# EAGLE design schizoid (EAGLE 7.6.0)
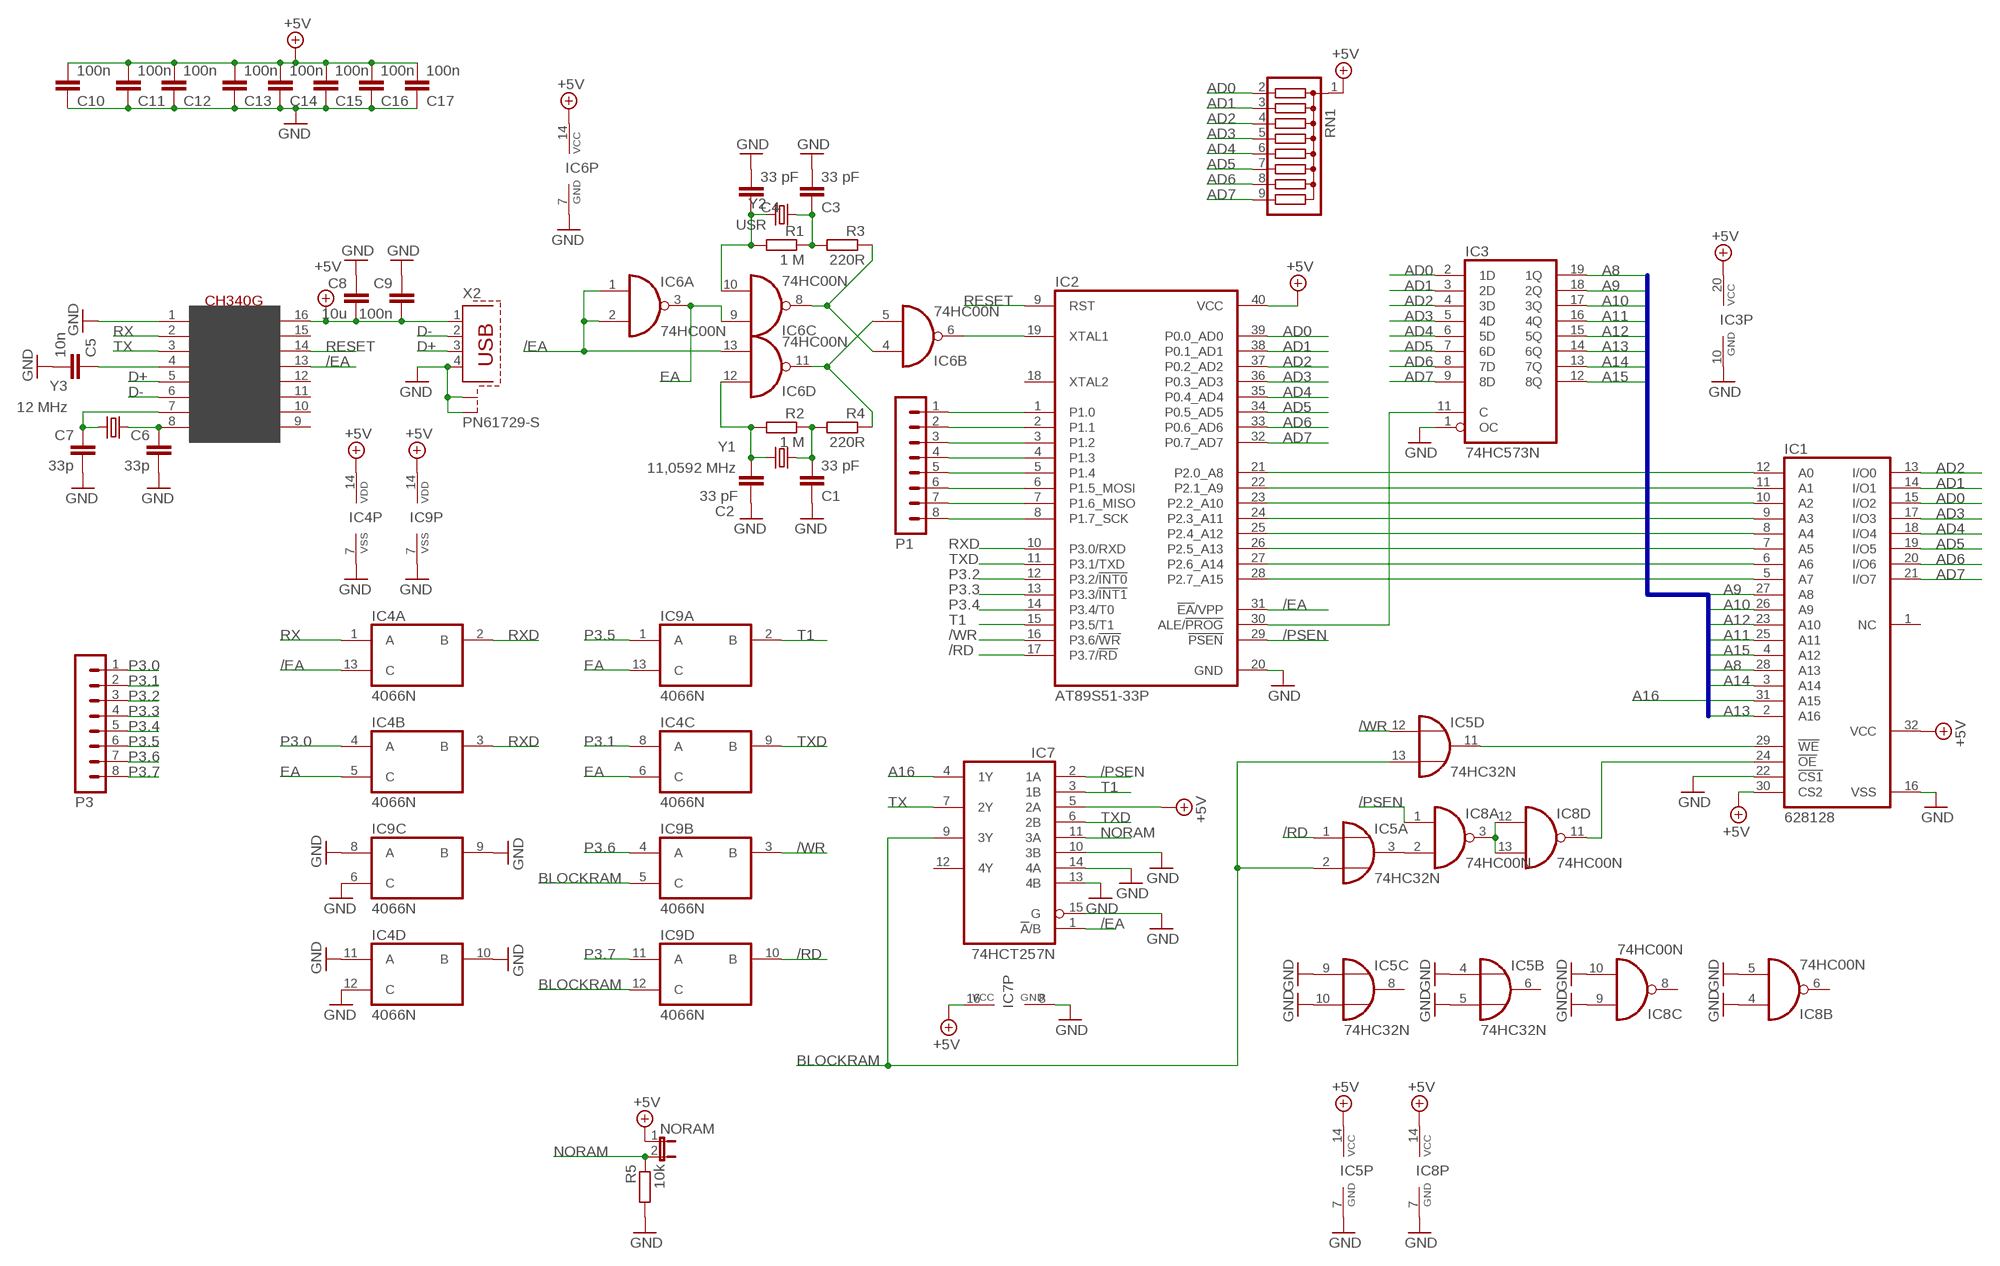
[diagram p0: schematic, sheet 1]

## Parts
C1  33 pF  C-EU025-025X050  [C025-025X050]
C2  33 pF  C-EU025-025X050  [C025-025X050]
C3  33 pF  C-EU025-025X050  [C025-025X050]
C4  33 pF  C-EU025-025X050  [C025-025X050]
C5  10n  C-EU025-025X050  [C025-025X050]
C6  33p  C-EU025-025X050  [C025-025X050]
C7  33p  C-EU025-025X050  [C025-025X050]
C8  10u  C-EU025-025X050  [C025-025X050]
C9  100n  C-EU025-025X050  [C025-025X050]
C10  100n  C-EU025-025X050  [C025-025X050]
C11  100n  C-EU025-025X050  [C025-025X050]
C12  100n  C-EU025-025X050  [C025-025X050]
C13  100n  C-EU025-025X050  [C025-025X050]
C14  100n  C-EU025-025X050  [C025-025X050]
C15  100n  C-EU025-025X050  [C025-025X050]
C16  100n  C-EU025-025X050  [C025-025X050]
C17  100n  C-EU025-025X050  [C025-025X050]
IC1  628128  628128P  [DIL32]
IC2  AT89S51-33P  [DIL40]
IC3  74HC573N  [DIL20]
IC4  4066N  [DIL14]
IC5  74HC32N  [DIL14]
IC6  74HC00N  [DIL14]
IC7  74HCT257N  [DIL16]
IC8  74HC00N  [DIL14]
IC9  4066N  [DIL14]
NORAM  JP1E  [JP1]
P1  MA08-1  [MA08-1]
P3  MA08-1  [MA08-1]
R1  1 M  R-EU_0207/7  [0207/7]
R2  1 M  R-EU_0207/7  [0207/7]
R3  220R  R-EU_0207/7  [0207/7]
R4  220R  R-EU_0207/7  [0207/7]
R5  10k  R-EU_0207/7  [0207/7]
RN1  G08R  [SIL9]
U$1  CH340G  [SOIC16]
X2  PN61729-S  [PN61729-S]
Y1  11,0592 MHz  CRYSTALHC49UV  [HC49U-V]
Y2  USR  CRYSTALHC49UV  [HC49U-V]
Y3  12 MHz  CRYSTALHC49UV  [HC49U-V]

## Nets
+5V: C8.2 C9.2 C10.2 C11.2 C12.2 C13.2 C14.2 C15.2 C16.2 C17.2 IC1.30(CS2) IC1.32(VCC) IC2.40(VCC) IC3.20(VCC) IC4.14(P:VDD) IC5.14(P:VCC) IC6.14(P:VCC) IC7.5(2A) IC7.16(VCC) IC8.14(P:VCC) IC9.14(P:VDD) NORAM.1 RN1.1 U$1.16(VCC) X2.1
/EA: IC2.31(!EA!/VPP) IC4.13(A:C) IC6.1(A:I0) IC6.2(A:I1) IC6.13(D:I1) IC7.1(!A!/B) U$1.13(DTR)
/PSEN: IC2.29(!PSEN) IC7.2(1A) IC8.1(A:I0)
/RD: IC2.17(P3.7/!RD) IC5.1(A:I0) IC9.10(D:B)
/WR: IC2.16(P3.6/!WR) IC5.12(D:I0) IC9.3(B:B)
A8: IC1.28(A13) IC3.19(1Q)
A9: IC1.27(A8) IC3.18(2Q)
A10: IC1.26(A9) IC3.17(3Q)
A11: IC1.25(A11) IC3.16(4Q)
A12: IC1.23(A10) IC3.15(5Q)
A13: IC1.2(A16) IC3.14(6Q)
A14: IC1.3(A14) IC3.13(7Q)
A15: IC1.4(A12) IC3.12(8Q)
A16: IC1.31(A15) IC7.4(1Y)
AD0: IC1.15(I/O2) IC2.39(P0.0_AD0) IC3.2(1D) RN1.2
AD1: IC1.14(I/O1) IC2.38(P0.1_AD1) IC3.3(2D) RN1.3
AD2: IC1.13(I/O0) IC2.37(P0.2_AD2) IC3.4(3D) RN1.4
AD3: IC1.17(I/O3) IC2.36(P0.3_AD3) IC3.5(4D) RN1.5
AD4: IC1.18(I/O4) IC2.35(P0.4_AD4) IC3.6(5D) RN1.6
AD5: IC1.19(I/O5) IC2.34(P0.5_AD5) IC3.7(6D) RN1.7
AD6: IC1.20(I/O6) IC2.33(P0.6_AD6) IC3.8(7D) RN1.8
AD7: IC1.21(I/O7) IC2.32(P0.7_AD7) IC3.9(8D) RN1.9
BLOCKRAM: IC5.2(A:I1) IC5.13(D:I1) IC7.9(3Y) IC9.5(B:C) IC9.12(D:C)
D+: U$1.5(D+) X2.3
D-: U$1.6(D-) X2.2
EA: IC4.5(B:C) IC4.6(C:C) IC6.3(A:O) IC6.9(C:I0) IC9.13(A:C)
GND: C1.1 C2.1 C3.2 C4.2 C5.2 C6.2 C7.2 C8.1 C9.1 C10.1 C11.1 C12.1 C13.1 C14.1 C15.1 C16.1 C17.1 IC1.16(VSS) IC1.22(!CS1) IC2.20(GND) IC3.1(OC) IC3.10(GND) IC4.7(P:VSS) IC4.10(D:B) IC4.11(D:A) IC4.12(D:C) IC5.4(B:I0) IC5.5(B:I1) IC5.7(P:GND) IC5.9(C:I0) IC5.10(C:I1) IC6.7(P:GND) IC7.8(GND) IC7.10(3B) IC7.13(4B) IC7.14(4A) IC7.15(G) IC8.4(B:I0) IC8.5(B:I1) IC8.7(P:GND) IC8.9(C:I0) IC8.10(C:I1) IC9.6(C:C) IC9.7(P:VSS) IC9.8(C:A) IC9.9(C:B) R5.2 U$1.1(GND) X2.4 X2.S1 X2.S2
N$1: IC1.12(A0) IC2.21(P2.0_A8)
N$2: IC1.11(A1) IC2.22(P2.1_A9)
N$3: IC1.10(A2) IC2.23(P2.2_A10)
N$4: IC1.9(A3) IC2.24(P2.3_A11)
N$5: IC1.8(A4) IC2.25(P2.4_A12)
N$6: IC1.7(A5) IC2.26(P2.5_A13)
N$7: IC1.6(A6) IC2.27(P2.6_A14)
N$8: IC1.5(A7) IC2.28(P2.7_A15)
N$9: IC2.30(ALE/!PROG) IC3.11(C)
N$10: C3.1 R1.1 R3.2 Y2.1
N$11: IC2.1(P1.0) P1.1
N$12: C1.2 R2.1 R4.2 Y1.1
N$13: IC2.2(P1.1) P1.2
N$14: IC2.3(P1.2) P1.3
N$15: IC2.4(P1.3) P1.4
N$16: IC2.5(P1.4) P1.5
N$17: IC2.6(P1.5_MOSI) P1.6
N$18: IC2.7(P1.6_MISO) P1.7
N$19: IC5.3(A:O) IC8.2(A:I1)
N$20: IC6.4(B:I0) IC6.8(C:O) R3.1
N$21: IC8.3(A:O) IC8.12(D:I0) IC8.13(D:I1)
N$22: IC6.5(B:I1) IC6.11(D:O) R4.1
N$23: C2.2 IC6.12(D:I0) R2.2 Y1.2
N$24: IC2.8(P1.7_SCK) P1.8
N$25: C4.1 IC6.10(C:I1) R1.2 Y2.2
N$26: IC2.19(XTAL1) IC6.6(B:O)
N$27: C5.1 U$1.4(V3)
N$28: C6.1 U$1.8(XO) Y3.1
N$31: C7.1 U$1.7(XI) Y3.2
N$35: IC1.29(!WE) IC5.11(D:O)
N$36: IC1.24(!OE) IC8.11(D:O)
NORAM: IC7.11(3A) NORAM.2 R5.1
P3.0: IC4.4(B:A) P3.1
P3.1: IC4.8(C:A) P3.2
P3.2: IC2.12(P3.2/!INT0) P3.3
P3.3: IC2.13(P3.3/!INT1) P3.4
P3.4: IC2.14(P3.4/T0) P3.5
P3.5: IC9.1(A:A) P3.6
P3.6: IC9.4(B:A) P3.7
P3.7: IC9.11(D:A) P3.8
RESET: IC2.9(RST) U$1.14(RTS)
RX: IC4.1(A:A) U$1.2(TX)
RXD: IC2.10(P3.0/RXD) IC4.2(A:B) IC4.3(B:B)
T1: IC2.15(P3.5/T1) IC7.3(1B) IC9.2(A:B)
TX: IC7.7(2Y) U$1.3(RX)
TXD: IC2.11(P3.1/TXD) IC4.9(C:B) IC7.6(2B)
Unconnected: IC1.1(NC) IC2.18(XTAL2) IC5.6(B:O) IC5.8(C:O) IC7.12(4Y) IC8.6(B:O) IC8.8(C:O) U$1.9(CTS) U$1.10(DSR) U$1.11(RI) U$1.12(DCD) U$1.15(RS232)

## Buses
A[8..16]

## Library data of the parts
C1-C17 = rcl:C-EU: CAPACITOR, European symbol
IC1 = memory-hitachi:628128P: MEMORY; OC_FARNELL: unknown; OC_NEWARK: unknown
IC2 = atmel:AT89S51-*: 8-bit Microcontroller with 4K BytesIn-System Programmable Flash Source: http://www.atmel.com/dyn/resources/prod_documents/doc2487.pdf; MPN: AT89S51-24PU; OC_FARNELL: 1095739; OC_NEWARK: 96K6578
IC3 = 74xx-eu:74*573: 8-bit D latch BUS DRIVER
IC4 IC9 = 40xx:4066: Quad bilateral ANALOG SWITCH
IC5 = 74xx-eu:74*32: Quad 2-input OR gate
IC6 IC8 = 74xx-eu:74*00: Quad 2-input NAND gate
IC7 = 74xx-eu:74*257: Quadruple 2-to 1 line data SELECTOR/MULTIPLEXER
NORAM = jumper:JP1E: JUMPER
P1 P3 = con-lstb:MA08-1: PIN HEADER; OC_FARNELL: unknown; OC_NEWARK: unknown
R1-R5 = rcl:R-EU_: RESISTOR, European symbol
RN1 = resistor-sil:G08R: SIL RESISTOR; OC_FARNELL: unknown; OC_NEWARK: unknown
U$1 = usb-serial:CH340G
X2 = con-berg:PN61729-S: BERG USB connector; OC_FARNELL: unknown; OC_NEWARK: unknown
Y1-Y3 = SparkFun-FreqCtrl:CRYSTAL: Various standard crystals. Proven footprints.

## Board
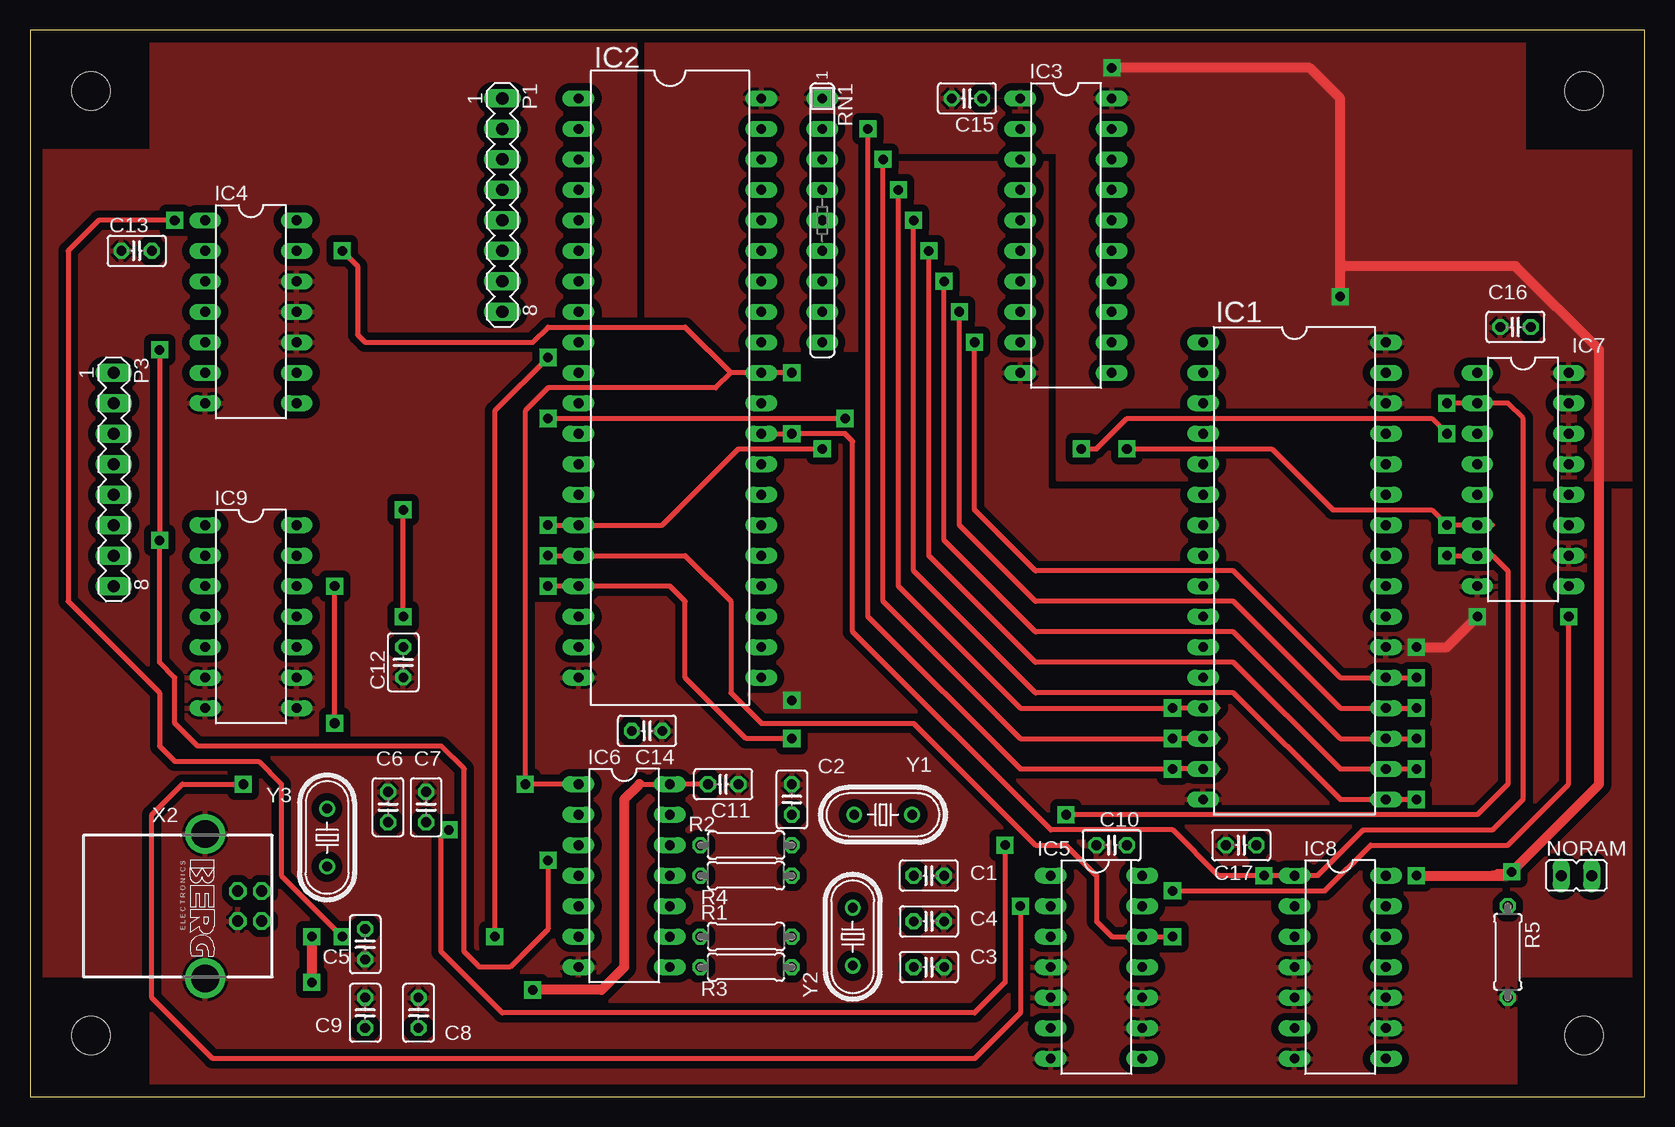
[diagram p1: board, top side]
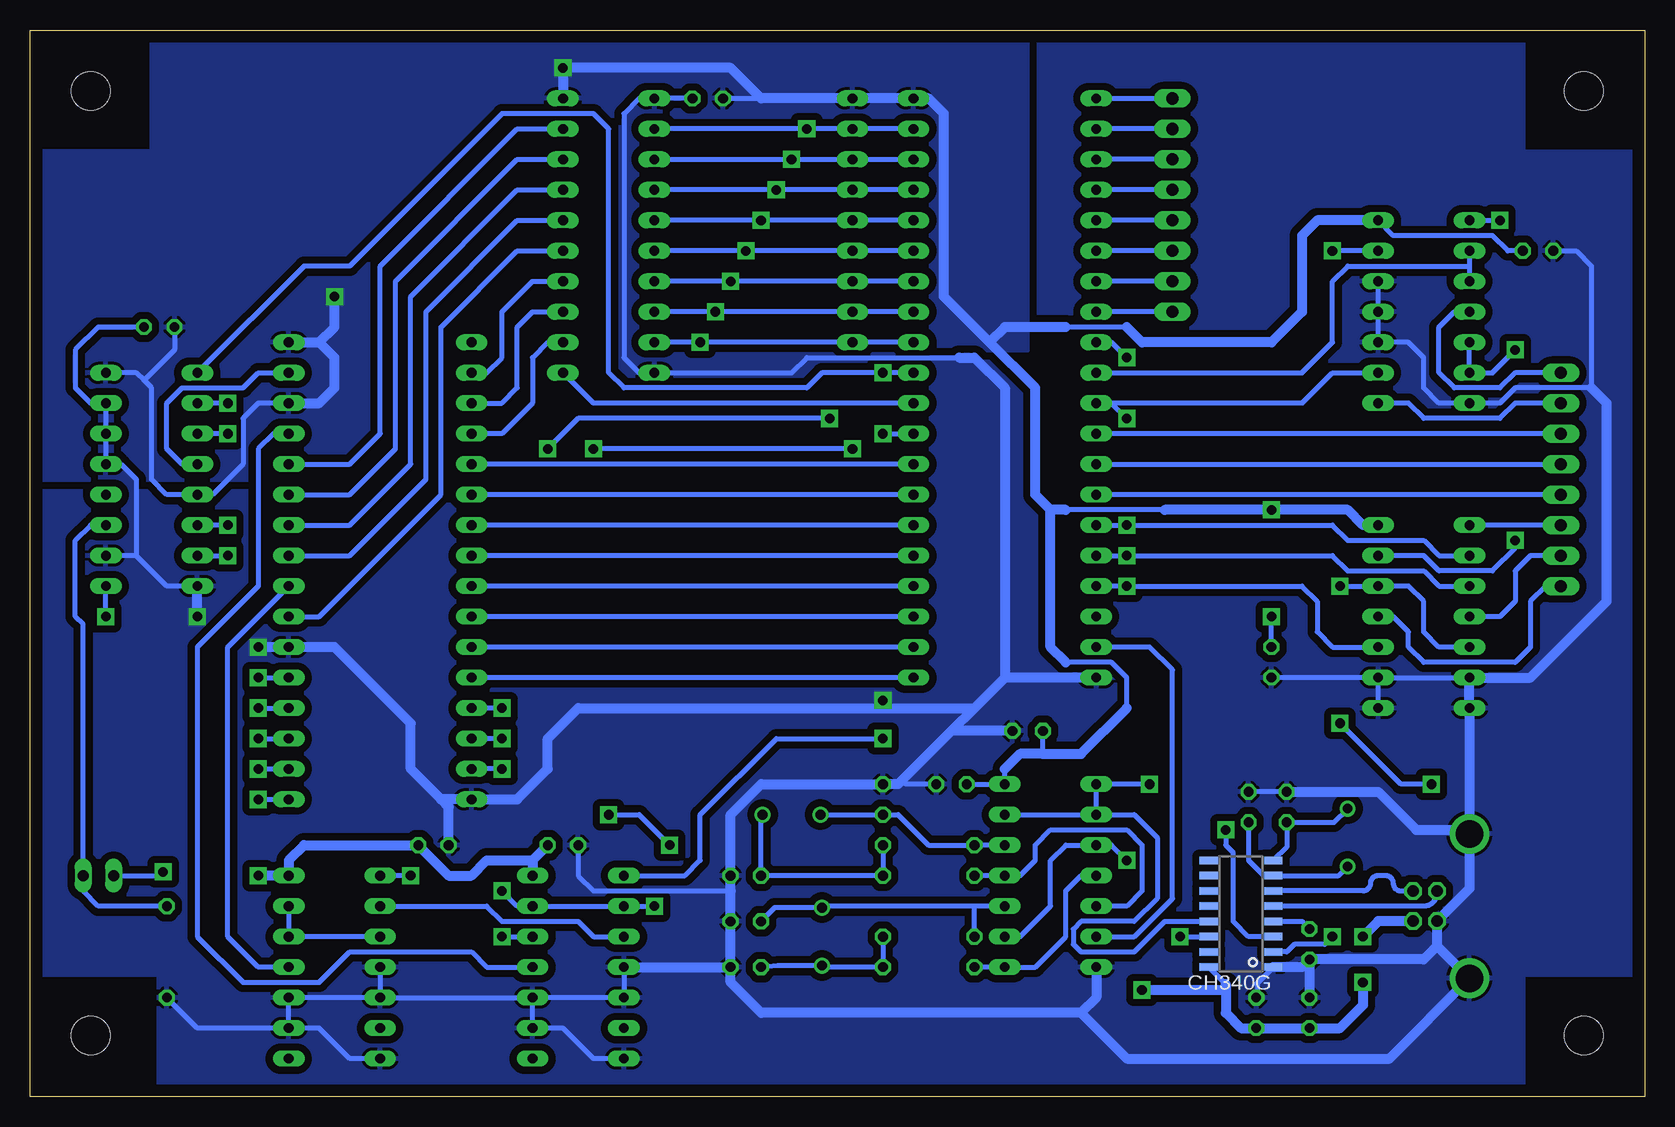
[diagram p2: board, bottom side, seen from below]

Size 134.6 x 88.89 mm. Coordinates in mm from the lower left corner, seen from the top.
Outline: 0,0 134.6,0 134.6,88.89 0,88.89 0,0
Copper layers (1*16): Top 0.035mm / dielectric 1.5mm / Bottom 0.035mm
Design rules "default": minimum track width 10mil, minimum drill 24mil, track to track 8mil, track to pad 8mil, pad to pad 8mil, via to via 8mil, smd to smd 8mil, copper to edge 40mil, drill to drill 8mil, minimum pad ring 10mil, minimum via ring 8mil, stop-mask expansion 4mil, vias tented up to drill 0mil, thermal gap 10mil
Holes 3.2 mm at 5.08,5.08 129.54,5.08 129.54,83.82 5.08,83.82

### Footprints (pad centres in the part's own frame; a part is rotated, then mirrored left to right if it is on the bottom)
C025-025X050 = drill 0.813 octagon: 1 -1.27,0; 2 1.27,0
DIL32 = drill 0.813 long: 1 -19.05,-7.62; 2 -16.51,-7.62; 3 -13.97,-7.62; 4 -11.43,-7.62; 5 -8.89,-7.62; 6 -6.35,-7.62; 7 -3.81,-7.62; 8 -1.27,-7.62; 9 1.27,-7.62; 10 3.81,-7.62; 11 6.35,-7.62; 12 8.89,-7.62; 13 11.43,-7.62; 14 13.97,-7.62; 15 16.51,-7.62; 16 19.05,-7.62; 17 19.05,7.62; 18 16.51,7.62; 19 13.97,7.62; 20 11.43,7.62; 21 8.89,7.62; 22 6.35,7.62; 23 3.81,7.62; 24 1.27,7.62; 25 -1.27,7.62; 26 -3.81,7.62; 27 -6.35,7.62; 28 -8.89,7.62; 29 -11.43,7.62; 30 -13.97,7.62; 31 -16.51,7.62; 32 -19.05,7.62
DIL40 = drill 0.813 long: 1 -24.13,-7.62; 2 -21.59,-7.62; 3 -19.05,-7.62; 4 -16.51,-7.62; 5 -13.97,-7.62; 6 -11.43,-7.62; 7 -8.89,-7.62; 8 -6.35,-7.62; 9 -3.81,-7.62; 10 -1.27,-7.62; 11 1.27,-7.62; 12 3.81,-7.62; 13 6.35,-7.62; 14 8.89,-7.62; 15 11.43,-7.62; 16 13.97,-7.62; 17 16.51,-7.62; 18 19.05,-7.62; 19 21.59,-7.62; 20 24.13,-7.62; 21 24.13,7.62; 22 21.59,7.62; 23 19.05,7.62; 24 16.51,7.62; 25 13.97,7.62; 26 11.43,7.62; 27 8.89,7.62; 28 6.35,7.62; 29 3.81,7.62; 30 1.27,7.62; 31 -1.27,7.62; 32 -3.81,7.62; 33 -6.35,7.62; 34 -8.89,7.62; 35 -11.43,7.62; 36 -13.97,7.62; 37 -16.51,7.62; 38 -19.05,7.62; 39 -21.59,7.62; 40 -24.13,7.62
DIL20 = drill 0.813 long: 1 -11.43,-3.81; 2 -8.89,-3.81; 3 -6.35,-3.81; 4 -3.81,-3.81; 5 -1.27,-3.81; 6 1.27,-3.81; 7 3.81,-3.81; 8 6.35,-3.81; 9 8.89,-3.81; 10 11.43,-3.81; 11 11.43,3.81; 12 8.89,3.81; 13 6.35,3.81; 14 3.81,3.81; 15 1.27,3.81; 16 -1.27,3.81; 17 -3.81,3.81; 18 -6.35,3.81; 19 -8.89,3.81; 20 -11.43,3.81
DIL14 = drill 0.813 long: 1 -7.62,-3.81; 2 -5.08,-3.81; 3 -2.54,-3.81; 4 0,-3.81; 5 2.54,-3.81; 6 5.08,-3.81; 7 7.62,-3.81; 8 7.62,3.81; 9 5.08,3.81; 10 2.54,3.81; 11 0,3.81; 12 -2.54,3.81; 13 -5.08,3.81; 14 -7.62,3.81
DIL16 = drill 0.813 long: 1 -8.89,-3.81; 2 -6.35,-3.81; 3 -3.81,-3.81; 4 -1.27,-3.81; 5 1.27,-3.81; 6 3.81,-3.81; 7 6.35,-3.81; 8 8.89,-3.81; 9 8.89,3.81; 10 6.35,3.81; 11 3.81,3.81; 12 1.27,3.81; 13 -1.27,3.81; 14 -3.81,3.81; 15 -6.35,3.81; 16 -8.89,3.81
JP1 = drill 0.914 long: 1 0,-1.27; 2 0,1.27
MA08-1 = drill 1.016 long: 1 -8.89,0; 2 -6.35,0; 3 -3.81,0; 4 -1.27,0; 5 1.27,0; 6 3.81,0; 7 6.35,0; 8 8.89,0
0207/7 = drill 0.813 octagon: 1 -3.81,0; 2 3.81,0
SIL9 = drill 0.813 long: 1 -10.16,0; 2 -7.62,0; 3 -5.08,0; 4 -2.54,0; 5 0,0; 6 2.54,0; 7 5.08,0; 8 7.62,0; 9 10.16,0
SOIC16 = smd 0.635 x 1.524: 1 -4.445,-2.695; 2 -3.175,-2.695; 3 -1.905,-2.695; 4 -0.635,-2.695; 5 0.635,-2.695; 6 1.905,-2.695; 7 3.175,-2.695; 8 4.445,-2.695; 9 4.445,2.695; 10 3.175,2.695; 11 1.905,2.695; 12 0.635,2.695; 13 -0.635,2.695; 14 -1.905,2.695; 15 -3.175,2.695; 16 -4.445,2.695
PN61729-S = drill 0.95 octagon: 1 1.25,4.71; 2 -1.25,4.71; 3 -1.25,2.71; 4 1.25,2.71 | drill 2.3 pad 2.9: S1 -6.02,0; S2 6.02,0
HC49U-V = drill 0.813: 1 -2.413,0; 2 2.413,0

### Placement (x,y rotation side)
C1  74.93,18.41 180 top
C2  63.5,24.77 270 top
C3  74.93,10.79 0 top
C4  74.93,14.61 0 top
C5  27.94,12.7 270 top
C6  29.84,24.13 90 top
C7  33.02,24.13 90 top
C8  32.38,6.99 270 top
C9  27.94,6.99 270 top
C10  90.17,20.95 0 top
C11  57.78,26.04 180 top
C12  31.11,36.2 90 top
C13  8.89,70.48 0 top
C14  51.44,30.48 180 top
C15  78.11,83.19 180 top
C16  123.83,64.14 180 top
C17  100.97,20.95 0 top
IC1  105.41,43.81 270 top
IC2  53.34,59.05 270 top
IC3  86.36,71.75 270 top
IC4  18.41,65.41 270 top
IC5  88.9,10.79 270 top
IC6  49.53,18.41 270 top
IC7  124.46,51.44 270 top
IC8  109.22,10.79 270 top
IC9  18.41,40.01 270 top
NORAM  128.91,18.41 270 top
P1  39.37,74.3 270 top
P3  6.99,51.44 270 top
R1  59.69,13.34 180 top
R2  59.69,20.95 180 top
R3  59.69,10.79 0 top
R4  59.69,18.41 0 top
R5  123.19,12.06 270 top
RN1  66.04,73.03 270 top
U$1  33.66,15.24 90 bottom
X2  14.61,15.88 270 top
Y1  71.12,23.5 180 top
Y2  68.58,13.34 90 top
Y3  24.77,21.59 270 top

### Tracks (layer width: path | path; a pad name or v marks a point on that pad's centre or on a via)
+5V  (via drill 0.8 pad 1.42)
  Top 0.406: v31.11,40.01 v31.11,48.9 | v123.51,18.73 122.24,18.73 121.92,18.41 | 50.8,26.04 IC6.14 C11.2
  Top 0.813: v109.22,66.67 109.22,69.22 | 109.22,69.22 109.22,83.19 106.68,85.72 v90.17,85.72 | v115.57,18.41 121.92,18.41 123.19,18.41 v123.51,18.73 130.81,26.04 130.81,62.23 123.83,69.22 109.22,69.22 | v23.5,13.34 v23.5,9.53 | v41.91,8.89 47.62,8.89 49.53,10.79 49.53,24.77 50.8,26.04
  Bottom 0.406: 125.09,59.69 124.46,59.05 124.46,51.44 123.19,50.16 IC7.5 119.38,50.16 116.84,52.7 116.84,56.52 115.57,57.78 IC1.30 | 125.09,59.69 125.73,60.33 IC7.16 | 40.01,48.9 48.26,48.9 | 43.18,64.14 48.26,64.14 | 43.18,32.38 43.18,34.92 44.45,36.2 48.26,36.2 | C12.2 v31.11,40.01 | C13.2 11.43,70.48 12.7,71.75 20.95,71.75 IC4.14 | 50.16,28.57 C14.2 | C15.2 73.66,83.19 | C16.2 122.56,62.23 125.09,59.69 | NORAM.1 123.83,18.41 v123.51,18.73 | 34.92,9.37 U$1.16 | C11.2 IC6.14 53.34,27.3
  Bottom 0.813: IC1.30 110.49,57.78 109.22,59.05 109.22,61.59 110.49,62.87 | IC1.32 110.49,62.87 | 110.49,62.87 109.22,64.14 v109.22,66.67 | IC3.20 v90.17,85.72 76.2,85.72 73.66,83.19 RN1.1 IC2.40 59.69,83.19 58.42,81.92 58.42,66.67 54.61,62.87 | IC9.14 23.5,47.62 24.77,48.9 v31.11,48.9 40.01,48.9 | 48.26,48.9 49.53,48.9 | 49.53,48.9 50.8,50.16 50.8,59.05 54.61,62.87 | IC4.14 27.3,73.03 28.57,71.75 28.57,65.41 31.11,62.87 41.91,62.87 43.18,64.14 | 48.26,64.14 53.34,64.14 54.61,62.87 | 43.18,32.38 46.99,28.57 50.16,28.57 52.07,28.57 53.34,27.3 | v115.57,18.41 IC8.14 113.03,19.68 111.76,20.95 C17.2 99.69,18.41 97.79,18.41 96.52,19.68 92.71,19.68 | 48.26,36.2 49.53,37.47 49.53,48.9 | C10.2 92.71,19.68 | 92.71,19.68 IC5.14 | X2.1 22.2,14.62 v23.5,13.34 | v23.5,9.53 23.5,7.62 25.4,5.71 C9.2 C8.2 33.66,5.71 34.92,6.99 34.92,8.89 | 34.92,9.37 34.92,8.89 | v41.91,8.89 34.92,8.89
  pour Bottom (isolate 0.61): 51.44,88.9 124.46,88.9 124.46,78.74 134.62,78.74 134.62,51.44 85.72,51.44 85.72,78.74 69.85,78.74 69.85,62.23 51.44,62.23
  pour Top (isolate 0.61): 51.44,88.9 124.46,88.9 124.46,78.74 134.62,78.74 134.62,51.44 85.72,51.44 85.72,78.74 69.85,78.74 69.85,62.23 51.44,62.23
/EA  (via drill 0.8 pad 1.42)
  Top 0.406: v63.5,60.33 58.42,60.33 | v26.04,70.48 27.3,69.22 27.3,63.5 27.94,62.87 41.91,62.87 43.18,64.14 54.61,64.14 58.42,60.33 | 58.42,60.33 57.15,59.05 43.18,59.05 41.27,57.15 v41.27,26.04 46.35,26.04
  Bottom 0.406: IC6.13 IC6.2 | IC6.2 IC6.1 v41.27,26.04 | IC7.1 111.76,69.22 107.95,69.22 95.25,81.92 87.63,81.92 86.36,80.64 86.36,60.33 85.09,59.05 69.85,59.05 68.58,60.33 v63.5,60.33 IC2.31 | IC4.13 v26.04,70.48 | IC6.2 42.55,23.5 40.64,21.59 40.64,16.51 42.55,14.61 46.99,14.61 47.62,13.97 47.62,12.7 46.99,12.06 42.55,12.06 40.01,14.61 U$1.13
/PSEN  (via drill 0.8 pad 1.42)
  Top 0.406: 60.33,55.24 v63.5,55.24 67.94,55.24 68.58,54.61 68.58,38.73 85.09,22.23 95.25,22.23 99.06,18.41 v102.87,18.41 107.31,18.41 111.12,22.23 121.92,22.23 124.46,24.77 124.46,56.52 123.19,57.78 v118.11,57.78
  Bottom 0.406: v63.5,55.24 IC2.29 | v102.87,18.41 IC8.1 | v118.11,57.78 IC7.2
/RD  (via drill 0.8 pad 1.42)
  Top 0.406: v63.5,29.84 59.69,29.84 54.61,34.92 54.61,41.27 53.34,42.55 v43.18,42.55
  Bottom 0.406: IC9.10 26.04,37.47 27.3,38.73 27.3,41.27 28.57,42.55 v43.18,42.55 IC2.17 | v63.5,29.84 72.39,29.84 78.74,23.5 78.74,19.68 80.01,18.41 IC5.1
/WR  (via drill 0.8 pad 1.42)
  Top 0.406: v43.18,45.09 54.61,45.09 58.42,41.27 58.42,33.66 60.96,31.11 73.66,31.11 83.82,20.95 86.36,20.95 88.9,18.41 88.9,14.61 90.17,13.34 v95.25,13.34
  Bottom 0.406: IC9.3 17.14,42.55 18.41,43.81 24.77,43.81 26.04,45.09 v43.18,45.09 IC2.16 | v95.25,13.34 IC5.12
A8
  Bottom 0.406: IC1.28 107.95,52.7 105.41,55.24 105.41,69.22 93.98,80.64 IC3.19
A9
  Bottom 0.406: IC1.27 107.95,50.16 104.14,53.98 104.14,67.94 93.98,78.11 IC3.18
A10
  Bottom 0.406: IC1.26 107.95,47.62 102.87,52.7 102.87,66.67 93.98,75.56 IC3.17
A11
  Bottom 0.406: IC1.25 107.95,45.09 101.6,51.44 101.6,65.41 93.98,73.03 IC3.16
A12
  Bottom 0.406: IC1.23 110.49,40.01 100.33,50.16 100.33,64.14 93.98,70.48 IC3.15
A13
  Bottom 0.406: IC1.2 96.52,60.33 95.25,61.59 95.25,65.41 92.71,67.94 IC3.14
A14
  Bottom 0.406: IC1.3 95.25,57.78 93.98,59.05 93.98,64.14 92.71,65.41 IC3.13
A15
  Bottom 0.406: IC3.12 91.44,62.87 92.71,61.59 92.71,57.78 95.25,55.24 IC1.4
A16
  Bottom 0.406: IC7.4 121.92,52.7 123.19,53.98 123.19,57.78 121.92,59.05 116.84,59.05 115.57,60.33 IC1.31
AD0  (via drill 0.8 pad 1.42)
  Top 0.406: v69.85,80.64 69.85,40.01 82.55,27.3 v95.25,27.3 99.06,27.3
  Bottom 0.406: IC2.39 RN1.2 v69.85,80.64 IC3.2 | v95.25,27.3 IC1.15
AD1  (via drill 0.8 pad 1.42)
  Top 0.406: v71.12,78.11 71.12,41.27 82.55,29.84 v95.25,29.84 99.06,29.84
  Bottom 0.406: IC3.3 v71.12,78.11 RN1.3 IC2.38 | v95.25,29.84 IC1.14
AD2  (via drill 0.8 pad 1.42)
  Top 0.406: v72.39,75.56 72.39,42.55 82.55,32.38 v95.25,32.38 99.06,32.38
  Bottom 0.406: IC2.37 RN1.4 v72.39,75.56 IC3.4 | v95.25,32.38 IC1.13
AD3  (via drill 0.8 pad 1.42)
  Top 0.406: v73.66,73.03 73.66,43.81 83.82,33.66 100.33,33.66 109.22,24.77 v115.57,24.77
  Bottom 0.406: IC2.36 RN1.5 v73.66,73.03 IC3.5 | v115.57,24.77 IC1.17
AD4  (via drill 0.8 pad 1.42)
  Top 0.406: v74.93,70.48 74.93,45.09 83.82,36.2 100.33,36.2 109.22,27.3 v115.57,27.3
  Bottom 0.406: IC2.35 RN1.6 v74.93,70.48 IC3.6 | v115.57,27.3 IC1.18
AD5  (via drill 0.8 pad 1.42)
  Top 0.406: v76.2,67.94 76.2,46.35 83.82,38.73 100.33,38.73 109.22,29.84 v115.57,29.84
  Bottom 0.406: IC2.34 RN1.7 v76.2,67.94 IC3.7 | v115.57,29.84 IC1.19
AD6  (via drill 0.8 pad 1.42)
  Top 0.406: v77.47,65.41 77.47,47.62 83.82,41.27 100.33,41.27 109.22,32.38 v115.57,32.38
  Bottom 0.406: IC2.33 RN1.8 v77.47,65.41 IC3.8 | v115.57,32.38 IC1.20
AD7  (via drill 0.8 pad 1.42)
  Top 0.406: v78.74,62.87 78.74,48.9 83.82,43.81 100.33,43.81 109.22,34.92 v115.57,34.92
  Bottom 0.406: IC2.32 RN1.9 v78.74,62.87 IC3.9 | v115.57,34.92 IC1.21
BLOCKRAM  (via drill 0.8 pad 1.42)
  Top 0.406: v95.25,17.14 107.95,17.14 111.76,20.95 123.19,20.95 128.27,26.04 v128.27,40.01 | v82.55,15.88 82.55,6.99 78.74,3.17 15.24,3.17 10.16,8.26 10.16,23.5 12.7,26.04 v17.78,26.04 | v25.4,31.11 v25.4,42.55
  Bottom 0.406: IC9.5 17.14,37.47 18.41,38.73 18.41,41.27 19.68,42.55 IC9.12 v25.4,42.55 | v95.25,17.14 93.98,15.88 IC5.13 IC5.2 v82.55,15.88 | v128.27,40.01 IC7.9 | v17.78,26.04 20.32,26.04 v25.4,31.11
D+
  Bottom 0.406: X2.3 17.32,16.98 arc90 18.41,15.88 U$1.5
D-
  Bottom 0.406: X2.2 20.3,17.12 arc90 20.95,17.78 arc-90 21.59,18.41 22.23,18.41 arc-90 22.86,17.78 arc90 23.5,17.14 U$1.6
EA  (via drill 0.8 pad 1.42)
  Top 0.406: v10.79,62.23 v10.79,46.35 10.79,36.2 12.06,34.92 12.06,31.11 13.97,29.21 34.29,29.21 36.2,27.3 36.2,12.06 37.47,10.79 40.01,10.79 43.18,13.97 v43.18,19.68
  Bottom 0.406: IC6.9 52.07,13.34 49.53,15.88 49.53,19.68 48.26,20.95 IC6.3 44.45,20.95 v43.18,19.68 | IC4.5 IC4.6 12.7,60.33 v10.79,62.23 | v10.79,46.35 10.79,45.72 12.7,43.81 17.14,43.81 18.41,45.09 IC9.13
GND  (via drill 0.8 pad 1.42)
  Top 0.813: v115.57,37.47 118.11,37.47 v120.65,40.01
  Bottom 0.406: 57.15,61.59 69.85,61.59 71.12,60.33 IC3.10 83.82,60.33 85.09,61.59 85.09,81.92 83.82,83.19 IC3.1 C15.1 | IC5.10 IC5.9 90.17,5.71 87.63,3.17 IC5.7 | IC5.4 IC5.5 IC5.10 | IC8.9 IC8.10 IC8.5 | IC8.7 107.95,3.17 110.49,5.71 IC8.9 | IC8.4 IC8.5 | IC7.8 123.19,42.55 125.73,45.09 | 125.73,45.09 IC7.10 | 125.73,45.09 125.73,51.44 127,52.7 IC7.13 IC7.14 IC7.15 129.54,57.78 130.81,59.05 130.81,62.23 128.91,64.14 C16.1 | 32.38,9.37 32.31,9.45 | 32.31,9.45 U$1.1 | C6.2 C7.2 | 32.31,9.45 32.31,8.33 C8.1 | IC9.8 IC9.9 | IC9.9 IC9.6 | IC4.12 IC4.11 IC4.10 19.68,62.87 18.41,61.59 18.41,59.05 17.14,57.78 IC4.7 12.06,57.78 10.79,59.05 4.45,59.05 4.45,69.22 5.71,70.48 C13.1 | IC8.5 IC5.10 | C11.1 61.59,26.04 61.91,26.35 | C10.1 88.9,18.41 87.63,17.14 76.2,17.14 | IC9.9 C12.1 | IC8.9 120.65,5.71 R5.2
  Bottom 0.813: IC2.20 53.34,34.92 | 57.15,61.59 55.88,61.59 53.34,59.05 53.34,34.92 | 55.88,32.38 88.9,32.38 91.44,29.84 91.44,27.3 93.98,24.77 IC1.16 100.33,24.77 | 55.88,32.38 53.34,34.92 | IC6.7 45.72,8.26 46.99,6.99 | 46.99,6.99 73.66,6.99 76.2,9.53 C3.2 | C3.2 C4.2 76.2,17.14 C1.1 76.2,23.5 73.66,26.04 C2.1 62.23,26.04 61.91,26.35 57.78,30.48 | 55.88,32.38 57.78,30.48 | X2.4 17.32,12.53 18.41,11.43 C5.2 | U$1.1 28.57,10.79 C5.2 | C5.2 C9.1 | X2.4 17.32,12.56 X2.S2 21.29,3.17 43.18,3.17 46.99,6.99 | X2.S1 14.61,17.34 X2.4 | X2.S1 IC9.7 IC9.6 9.53,34.92 3.17,41.27 3.17,57.78 4.45,59.05 | IC5.4 C3.2 | 100.33,24.77 102.87,27.3 102.87,31.11 109.22,37.47 IC1.22 v115.57,37.47 | v120.65,40.01 IC7.8 | C6.2 22.23,25.4 19.05,22.23 14.94,22.23 X2.S1 | C14.1 57.78,30.48 | C17.1 99.69,24.13 100.33,24.77
  other vias: 63.5,33.02
  pour Bottom (isolate 0.61, rank 4): 134.62,80.01 124.46,80.01 124.14,88.9 10.16,88.9 10.16,78.74 0,78.74 0,10.16 10.16,10.16 10.16,0 123.83,0 123.83,10.16 134.62,10.16
  pour Top (isolate 0.61, rank 4): 134.62,80.01 124.46,80.01 124.46,88.9 10.16,88.9 10.16,78.74 0,78.74 0,10.16 10.16,10.16 10.16,0 123.83,0 123.83,10.16 134.62,10.16
N$1
  Bottom 0.406: IC2.21 IC1.12
N$2
  Bottom 0.406: IC2.22 IC1.11
N$3
  Bottom 0.406: IC2.23 IC1.10
N$4
  Bottom 0.406: IC2.24 IC1.9
N$5
  Bottom 0.406: IC2.25 IC1.8
N$6
  Bottom 0.406: IC2.26 IC1.7
N$7
  Bottom 0.406: IC2.27 IC1.6
N$8
  Bottom 0.406: IC2.28 IC1.5
N$9
  Bottom 0.406: IC2.30 87.63,57.78 IC3.11
N$10
  Bottom 0.406: R1.1 R3.2 68.45,10.79 Y2.1 72.26,10.92 C3.1
N$11
  Bottom 0.406: IC2.1 P1.1
N$12
  Bottom 0.406: Y1.1 73.66,23.37 C1.2 R4.2 R2.1
N$13
  Bottom 0.406: P1.2 IC2.2
N$14
  Bottom 0.406: P1.3 IC2.3
N$15
  Bottom 0.406: P1.4 IC2.4
N$16
  Bottom 0.406: P1.5 IC2.5
N$17
  Bottom 0.406: P1.6 IC2.6
N$18
  Bottom 0.406: P1.7 IC2.7
N$19
  Bottom 0.406: IC8.2 96.52,15.88 95.25,14.61 88.9,14.61 87.63,13.34 IC5.3
N$20
  Bottom 0.406: R3.1 IC6.8 50.8,10.79 48.26,13.34 48.26,17.14 46.99,18.41 IC6.4
N$21
  Bottom 0.406: IC8.3 IC8.12 IC8.13
N$22
  Bottom 0.406: R4.1 IC6.11 52.07,18.41 50.8,19.68 50.8,20.95 49.53,22.23 43.18,22.23 41.91,20.95 41.91,17.14 43.18,15.88 IC6.5
N$23
  Bottom 0.406: IC6.12 R2.2 59.69,20.95 62.23,23.5 C2.2 Y1.2
N$24
  Bottom 0.406: P1.8 IC2.8
N$25
  Bottom 0.406: IC6.10 55.88,15.88 | 55.88,15.88 68.45,15.88 Y2.2 72.52,15.75 C4.1 | R1.2 55.88,15.88
N$26
  Bottom 0.406: IC6.6 42.55,13.34 39.37,16.51 39.37,35.56 41.27,37.47 IC2.19
N$27
  Bottom 0.406: U$1.4 28.57,14.61 C5.1
N$28
  Bottom 0.406: U$1.8 29.84,20.8 C6.1 25.91,22.86 Y3.1
N$31
  Bottom 0.406: Y3.2 25.53,18.41 U$1.7 31.75,18.41 33.02,19.68 C7.1
N$35
  Bottom 0.406: IC1.29 114.3,55.24 115.57,53.98 115.57,42.55 120.65,37.47 120.65,13.34 116.84,9.53 110.49,9.53 107.95,12.06 97.79,12.06 96.52,10.79 IC5.11
N$36
  Bottom 0.406: IC1.24 118.11,37.47 118.11,13.34 115.57,10.79 IC8.11
NORAM
  Bottom 0.406: R5.1 128.91,15.88 130.18,17.14 NORAM.2 130.18,39.37 130.81,40.01 130.81,46.35 129.54,47.62 IC7.11
P3.0
  Bottom 0.406: P3.1 10.79,60.33 12.06,59.05 15.88,59.05 17.14,60.33 17.14,64.14 15.88,65.41 IC4.4
P3.1
  Bottom 0.406: P3.2 10.79,57.78 12.06,56.52 18.41,56.52 19.68,57.78 IC4.8
P3.2
  Bottom 0.406: P3.3 IC2.12
P3.3
  Bottom 0.406: IC2.13 P3.4
P3.4
  Bottom 0.406: P3.5 IC2.14
P3.5
  Bottom 0.406: P3.6 IC9.1
P3.6
  Bottom 0.406: P3.7 9.53,45.09 10.79,43.81 10.79,41.27 12.06,40.01 IC9.4
P3.7
  Bottom 0.406: P3.8 8.26,42.55 9.53,41.27 9.53,37.47 10.79,36.2 18.41,36.2 19.68,37.47 19.68,38.73 20.95,40.01 IC9.11
RESET  (via drill 0.8 pad 1.42)
  Top 0.406: v43.18,61.59 38.73,57.15 v38.73,13.34
  Bottom 0.406: IC2.9 44.45,62.87 v43.18,61.59 | v38.73,13.34 U$1.14
RX  (via drill 0.8 pad 1.42)
  Top 0.406: v12.06,73.03 5.71,73.03 3.17,70.48 3.17,41.27 10.79,33.66 10.79,29.21 12.06,27.94 19.05,27.94 20.95,26.04 20.95,18.41 v26.04,13.34
  Bottom 0.406: IC4.1 v12.06,73.03 | v26.04,13.34 26.67,12.7 29.21,12.7 29.84,12.06 U$1.2
RXD
  Bottom 0.406: IC4.2 14.61,69.22 | 14.61,69.22 IC4.3 | IC2.10 28.57,60.33 26.04,62.87 26.04,67.94 24.77,69.22 14.61,69.22
T1  (via drill 0.8 pad 1.42)
  Top 0.406: v43.18,47.62 52.7,47.62 59.05,53.98 v66.04,53.98 | v87.63,53.98 88.9,53.98 91.44,56.52 116.84,56.52 v118.11,55.24
  Bottom 0.406: IC9.2 17.14,45.09 18.41,46.35 24.77,46.35 26.04,47.62 v43.18,47.62 IC2.15 | v66.04,53.98 v87.63,53.98 | v118.11,55.24 IC7.3
TX  (via drill 0.8 pad 1.42)
  Top 0.406: v118.11,45.09 121.92,45.09 123.19,43.81 123.19,26.04 120.65,23.5 v86.36,23.5 | v81.28,20.95 81.28,9.53 78.74,6.99 39.37,6.99 34.29,12.06 34.29,21.59 v34.92,22.23
  Bottom 0.406: U$1.3 33.02,13.34 34.29,14.61 34.29,20.32 34.92,20.95 v34.92,22.23 | IC7.7 v118.11,45.09 | v86.36,23.5 83.82,23.5 v81.28,20.95
TXD  (via drill 0.8 pad 1.42)
  Top 0.406: v43.18,56.52 v67.94,56.52 | v91.44,53.98 103.5,53.98 108.58,48.9 116.84,48.9 v118.11,47.62 121.92,47.62
  Bottom 0.406: IC4.9 26.04,60.33 28.57,57.78 IC2.11 44.45,57.78 v43.18,56.52 | v67.94,56.52 88.9,56.52 v91.44,53.98 | v118.11,47.62 IC7.6